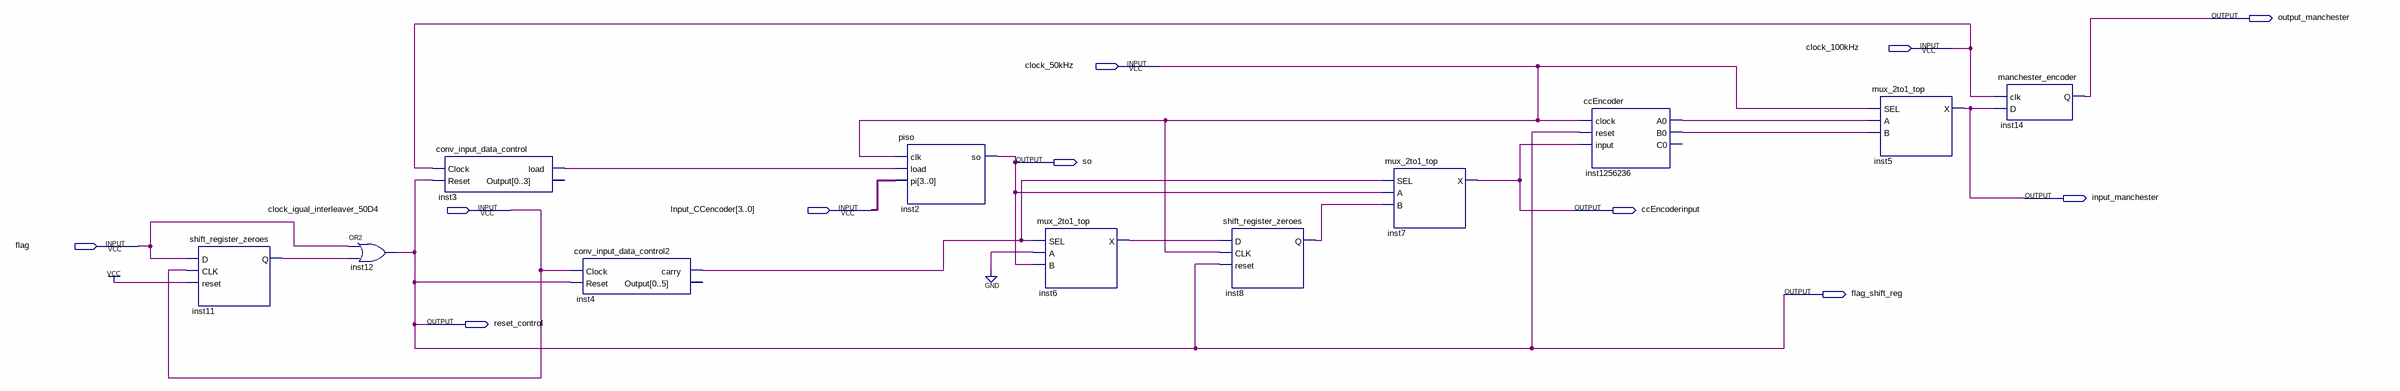
[diagram p0: schematic sheet]
// Quartus schematic encCCencoder.bdf as structural Verilog: 11 symbols, 11 pins
module encCCencoder (
  input  clock_100kHz,
  input  clock_50kHz,
  input  clock_igual_interleaver_50D4,
  input  [3:0] Input_CCencoder,
  input  flag,
  output output_manchester,
  output so,
  output input_manchester,
  output ccEncoderinput,
  output flag_shift_reg,
  output reset_control
);

  wire inst3_load, inst4_carry, inst6_x, inst8_q, inst11_q, inst1256236_a0, inst1256236_b0;

  shift_register_zeroes inst11 (.D(flag), .CLK(clock_igual_interleaver_50D4), .reset(1'b1), .Q(inst11_q));
  or inst12 (flag_shift_reg, flag, inst11_q);
  conv_input_data_control inst3 (.Clock(clock_100kHz), .Reset(flag_shift_reg), .load(inst3_load));  // open: Output
  conv_input_data_control2 inst4 (
    .Clock(clock_igual_interleaver_50D4), .Reset(flag_shift_reg), .carry(inst4_carry));  // open: Output
  piso inst2 (.clk(clock_50kHz), .load(inst3_load), .pi(Input_CCencoder), .so(so));
  mux_2to1_top inst6 (.SEL(inst4_carry), .A(1'b0), .B(so), .X(inst6_x));
  shift_register_zeroes inst8 (.D(inst6_x), .CLK(clock_50kHz), .reset(flag_shift_reg), .Q(inst8_q));
  mux_2to1_top inst7 (.SEL(inst4_carry), .A(so), .B(inst8_q), .X(ccEncoderinput));
  ccEncoder inst1256236 (
    .clock(clock_50kHz), .reset(flag_shift_reg), .\input (ccEncoderinput), .A0(inst1256236_a0),
    .B0(inst1256236_b0));  // open: C0
  mux_2to1_top inst5 (.SEL(clock_50kHz), .A(inst1256236_a0), .B(inst1256236_b0), .X(input_manchester));
  manchester_encoder inst14 (.clk(clock_100kHz), .D(input_manchester), .Q(output_manchester));

  assign reset_control = flag_shift_reg;
endmodule
